# EAGLE design PowerCell-v13 (EAGLE 6.4)
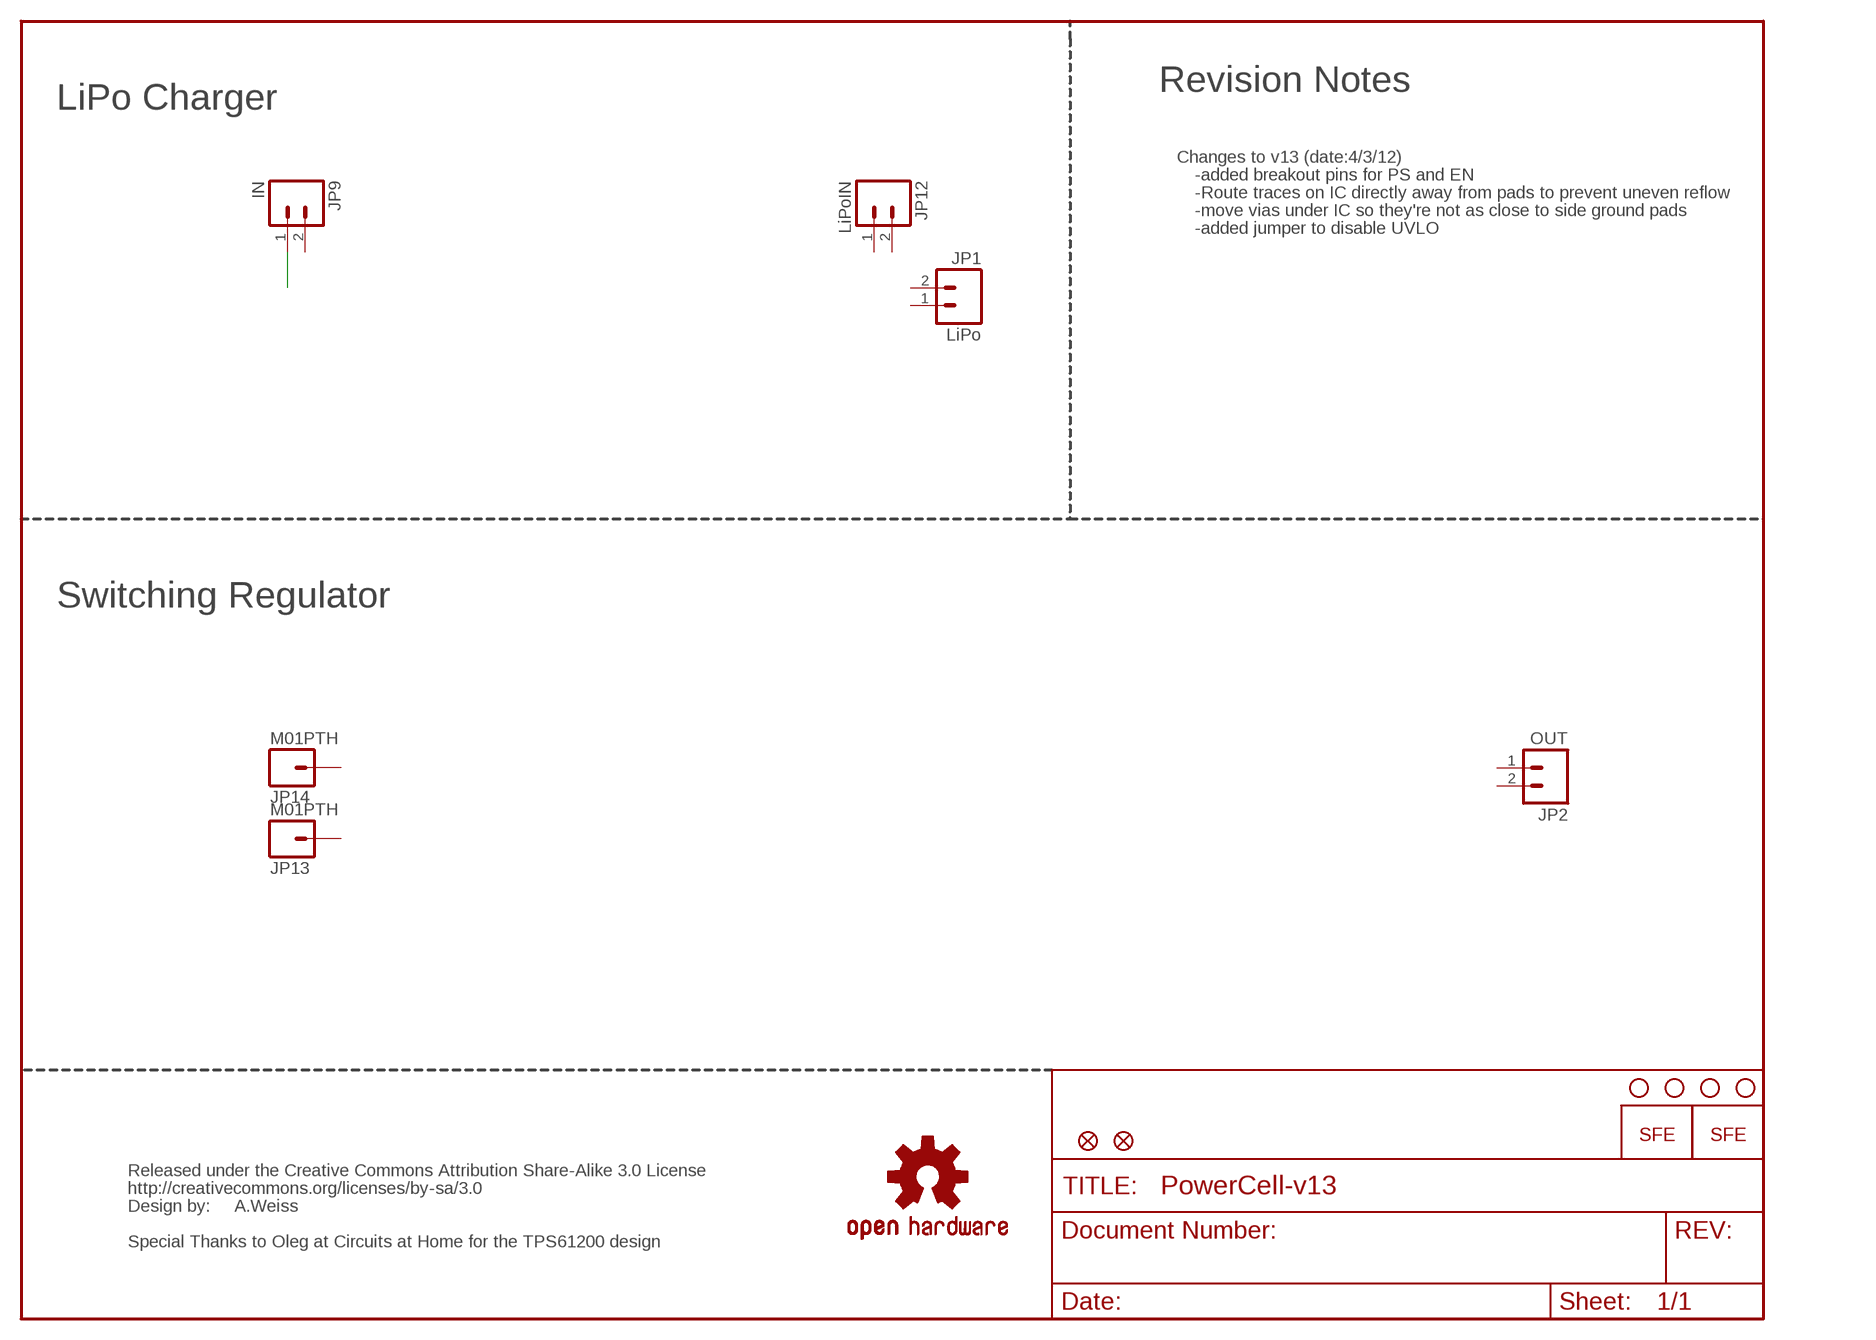
[diagram p0: schematic, sheet 1]

## Parts
JP1  LiPo  M02-JST-2MM-SMT  [JST-2-SMD]
JP2  OUT  M02PTH  [1X02]
JP3  LOGO-SFENEW  [SFE-NEW-WEBLOGO]
JP4  LOGO-SFESK  [SFE-LOGO-FLAME]
JP5  STAND-OFF  [STAND-OFF]
JP6  STAND-OFF  [STAND-OFF]
JP7  STAND-OFF  [STAND-OFF]
JP8  STAND-OFF  [STAND-OFF]
JP9  IN  M02PTH  [1X02]
JP12  LiPoIN  M02PTH  [1X02]
JP13  M01PTH  [1X01]
JP14  M01PTH  [1X01]
JP15  FIDUCIALUFIDUCIAL  [MICRO-FIDUCIAL]
JP16  FIDUCIALUFIDUCIAL  [MICRO-FIDUCIAL]
U$1  OSHW-LOGOS  [OSHW-LOGO-S]
U$2  CREATIVE_COMMONS  [CREATIVE_COMMONS]

## Nets
N$2: JP9.1
Unconnected: JP1.1 JP1.2 JP2.1 JP2.2 JP9.2 JP12.1 JP12.2 JP13.1 JP14.1

## Notes on the sheet
- Revision Notes
- LiPo Charger
- Changes to v13 (date:4/3/12)
- -added breakout pins for PS and EN
- -Route traces on IC directly away from pads to prevent uneven reflow
- -move vias under IC so they're not as close to side ground pads
- -added jumper to disable UVLO
- Switching Regulator
- A.Weiss
- Special Thanks to Oleg at Circuits at Home for the TPS61200 design

## Library data of the parts
JP1 JP2 JP9 JP12 = SparkFun:M02: Header 2 Standard 2-pin 0.1" header. Use with straight break away headers (SKU : PRT-00116), right angle break away headers (PRT-00553), swiss pins (PRT-00743), machine pins (PRT-00117), and female headers (PRT-00115). Molex polarized connector foot print use with SKU : PRT-08233 with associated crimp pins and housings.
JP3 JP4 = SparkFun:LOGO-SFE: Spark Fun Electronics PCB Logo This is the standard Spark Fun Electronics PCB logo.
JP5-JP8 = SparkFun:STAND-OFF: Stand Off This is the mechanical footprint for a #4 phillips button head screw. Use the keepout ring to avoid running the screw head into surrounding components. SKU : PRT-00447
JP13 JP14 = SparkFun:M01: Header 1 Standard 1-pin 0.1" header. Use with straight break away headers (SKU : PRT-00116), right angle break away headers (PRT-00553), swiss pins (PRT-00743), machine pins (PRT-00117), and female headers (PRT-00115).
JP15 JP16 = SparkFun:FIDUCIAL: Fiducial Alignment Points Various fiducial points for machine vision alignment.
U$1 = SparkFun:OSHW-LOGO: Open Source Hardware Logo This logo indicates the piece of hardware it is found on incorporates a OSHW license and/or adheres to the definition of open source hardware found here: http://freedomdefined.org/OSHW
U$2 = SparkFun-Aesthetics:CREATIVE_COMMONS: Creative Commons License summary

## Board
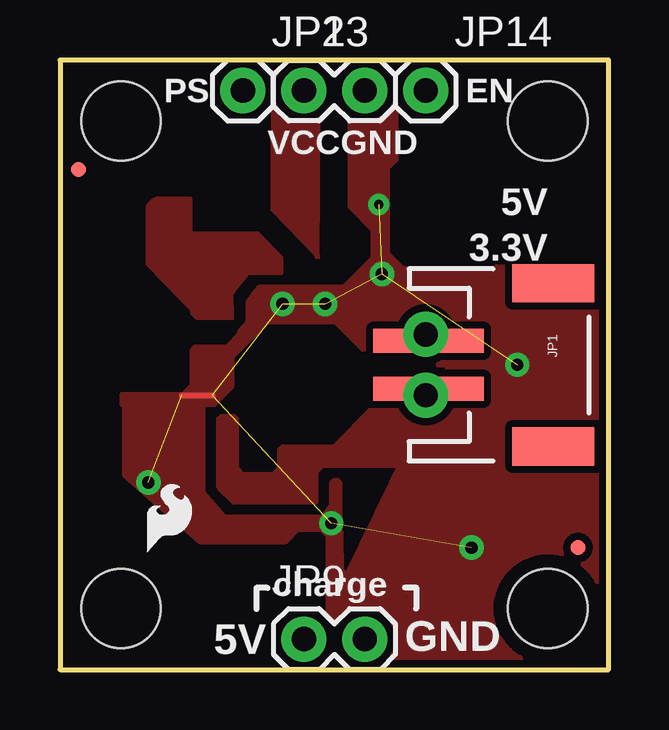
[diagram p1: board, top side]
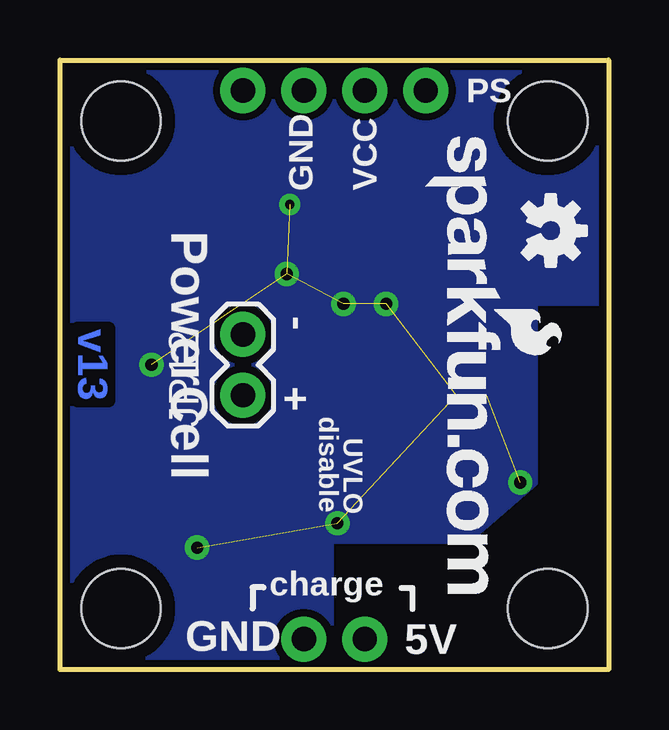
[diagram p2: board, bottom side, seen from below]

Size 22.86 x 25.4 mm. Coordinates in mm from the lower left corner, seen from the top.
Outline: 0,0 22.86,0 22.86,25.4 0,25.4 0,0
Copper layers (1*16): Top 0.035mm / dielectric 1.5mm / Bottom 0.035mm
Design rules "default": minimum track width 8mil, minimum drill 20mil, track to track 8mil, track to pad 8mil, pad to pad 8mil, via to via 8mil, smd to smd 8mil, copper to edge 8mil, drill to drill 8mil, minimum pad ring 12mil, minimum via ring 10mil, stop-mask expansion 4mil, vias tented up to drill 20mil, thermal gap 10mil

### Footprints (pad centres in the part's own frame; a part is rotated, then mirrored left to right if it is on the bottom)
JST-2-SMD = smd 1 x 4.6: 1 -1,-3.7; 2 1,-3.7 | smd 1.6 x 3.4: NC1 -3.4,1.5; NC2 3.4,1.5
1X02 = drill 1.016 pad 1.88: 1 0,0; 2 2.54,0
STAND-OFF = hole 3.302: 0,0
1X01 = drill 1.016 pad 1.88: 1 0,0
MICRO-FIDUCIAL = smd 0.635 x 0.635: 1 0,0

### Placement (x,y rotation side)
JP1  19.05,12.7 270 top
JP2  10.16,24.13 0 top
JP3  7.65,22.2 270 bottom
JP4  3.63,4.9 0 top
JP5  2.54,2.54 0 top
JP6  20.32,2.54 0 top
JP7  2.54,22.86 0 top
JP8  20.32,22.86 0 top
JP9  10.16,1.27 0 top
JP12  15.24,11.43 90 bottom
JP13  7.62,24.13 0 top
JP14  15.24,24.13 0 top
JP15  21.59,5.08 0 top
JP16  0.76,20.83 0 top
U$1  2.41,18.29 270 bottom
U$2  19.05,-10.16 0 top  (outside the outline)

### Tracks (layer width: path | path; a pad name or v marks a point on that pad's centre or on a via)
GND  (via drill 0.38, 0.51)  (8 unrouted)
  Top 0.254: 5.08,11.43 6.35,11.43
  other vias: 9.27,15.24 11.05,15.24 19.05,12.7 13.41,16.48 11.3,6.1 3.68,7.8 17.14,5.08 13.28,19.38
  pour Bottom (isolate 0.305, no thermals): 0,25.4 0,15.24 3.05,15.24 3.05,7.75 5.84,5.33 11.56,5.33 11.56,0 22.86,0 22.86,25.4
  pour Top (isolate 0.305, no thermals): 2.62,11.05 2.62,11.46 5.16,11.46 5.54,11.84 5.54,13.31 5.66,13.44 6.96,13.44 7.59,14.07 7.49,14.07 7.87,14.5 7.87,15.32 8.18,15.75 8.23,15.8 8.33,15.93 8.56,15.93 11.89,15.95 13.08,17.14 13.08,18.31 12.12,19.28 12.12,22.91 11.71,23.32 11.71,25.4 13.97,25.4 13.97,21.26 13.61,20.9 13.61,17.32 14.22,16.71 17.58,16.69 18.41,16.74 18.29,12.7 13.31,12.7 11.51,14.5 8.61,14.5 7.14,13.03 7.14,11.81 6.38,11.05
  pour Top (isolate 0.305, no thermals): 2.67,11.05 2.67,8.13 5.84,5.33 9.4,5.33 9.91,5.84 11.05,5.84 11.56,5.33 11.56,0 22.86,0 22.86,16.76 18.16,16.76 11.94,3.94 11.68,4.19 11.68,7.75 11.56,7.87 11.43,7.87 11.3,7.75 11.3,6.86 10.92,6.35 6.86,6.35 5.97,7.37 5.97,11.05
  pour Top (isolate 0.305, no thermals): 16.51,5.46 15.62,5.46 15.62,4.06 16.64,4.06 16.64,5.33
  pour Top (isolate 0.305, no thermals): 10.9,5.87 10.9,5.84 11.15,5.59 11.15,2.39 11.48,2.06 11.58,2.06 11.76,2.24 11.71,5.71 11.58,5.89 11.58,6.2 11.43,6.35 11.38,6.35
N$2
  Top 0.711: 10.48,1.59 JP9.1
VBATT
  pour Top (isolate 0.305, no thermals): 8.2,18.16 9.19,17.14 9.19,16.54 7.8,16.54 7.52,16.18 7.11,15.65 7.14,14.66 5.74,14.66 5.54,14.86 5.54,15.01 4.06,16.48 4.06,16.51 3.68,16.89 3.68,19.3 3.94,19.56 4.06,19.61 5.41,19.61 5.41,18.16
  pour Top (isolate 0.305, no thermals): 13.08,12.06 13.08,10.92 11.43,9.27 9.27,9.27 9.14,9.14 9.14,8.38 8.89,8.13 7.62,8.13 7.37,8.38 7.37,10.41 7.24,10.54 6.73,10.54 6.6,10.41 6.6,7.62 7.24,6.99 10.67,6.99 10.67,8.26 10.92,8.51 15.24,8.51 17.65,10.92 17.65,12.06
VCC
  pour Top (isolate 0.305, no thermals): 8.89,25.4 8.86,19.18 10.72,17.27 10.72,17.17 10.77,23.06 11.18,23.47 11.18,25.4

### Text on the board
Bottom: v13
tPlace: PS | EN | VCC | GND | 5V | 3.3V | charge | 5V | GND
bPlace: PS | VCC | GND | PowerCell | - | disable | + | UVLO | charge | 5V | GND